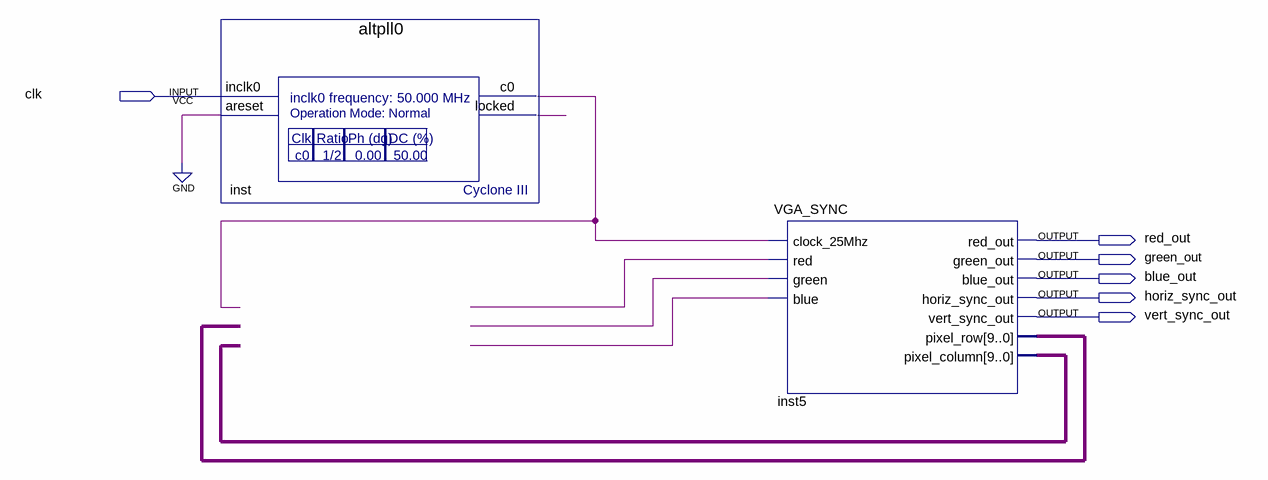
[diagram p0: schematic sheet]
// Quartus schematic VGAExample.bdf as structural Verilog: 2 symbols, 6 pins
module VGAExample (
  input  clk,
  output red_out,
  output green_out,
  output blue_out,
  output horiz_sync_out,
  output vert_sync_out
);

  wire inst_c0, inst_locked, undriven, undriven_2, undriven_3;
  wire [9:0] inst5_pixel_column, inst5_pixel_row;

  altpll0 inst (.inclk0(clk), .areset(1'b0), .c0(inst_c0), .locked(inst_locked));
  VGA_SYNC inst5 (
    .clock_25Mhz(inst_c0), .red(undriven_2), .green(undriven), .blue(undriven_3), .red_out(red_out),
    .green_out(green_out), .blue_out(blue_out), .horiz_sync_out(horiz_sync_out),
    .vert_sync_out(vert_sync_out), .pixel_row(inst5_pixel_row), .pixel_column(inst5_pixel_column));
endmodule
